# EasyEDA Pro project 四路舵机降压板.epro, board lm3150
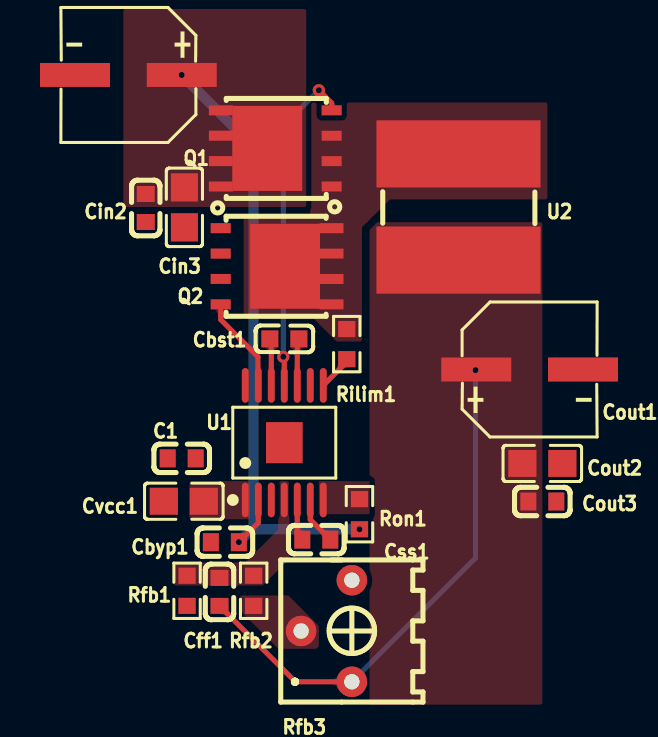
[diagram p5: board, top side]
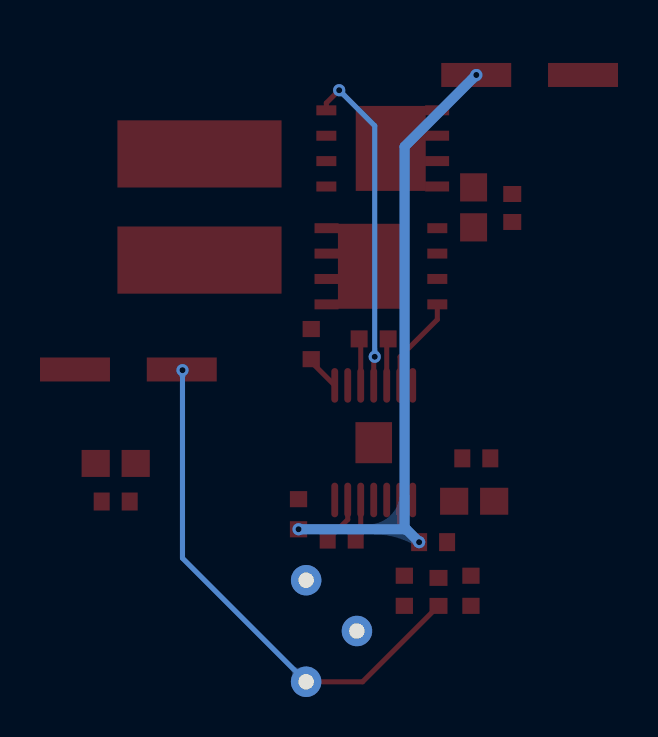
[diagram p6: board, bottom side, seen from below]

No outline. copper layers: Top Layer, Bottom Layer. Coordinates in mm from the lowest, leftmost part position.
Stack: Top Layer 0.035mm / Dielectric1 1.51mm FR4 er 4.5 / Bottom Layer 0.035mm

## Design rules (mm)
template: 自定义配置
spacing copperThickness1oz (default): track to track 0.102, other pairs 0.152 to 0.3
spacing copperThickness2oz: track to track 0.203, other pairs 0.152 to 0.3
track width copperThickness1oz (default): min 0.127, default 0.254, max 2.54
track width copperThickness2oz: min 0.203, default 0.254, max 2.54
differential pair differentialPair (default): width min 0.127, default 0.254, max 2.54; gap min 0.152, default 0.152
via viaSize (default): diameter min 0.5, default 0.61, max 10; hole min 0.3, default 0.305, max 6.3

## Placement (name value [footprint] x y rotation side)
C1  1nF  [C0603]  2.67 8.64 0 top
Cbst1  470nF  [CAP-SMD_L1.6-W0.8-3]  7.8 14.61 180 top
Cbyp1  100nF  [C0603]  4.83 4.45 0 top
Cff1  270pF  [C0603]  4.56 1.96 270 top
Cin1  220uF  [CAP-SMD_BD6.3-L6.6-W6.6-LS7.4-FD]  0 27.81 180 top
Cin2  100nF  [C0603]  0.87 21.16 90 top
Cin3  10uF  [C0805]  2.8 21.19 90 top
Cout1  220uF  [CAP-SMD_BD6.3-L6.6-W6.6-LS7.4-FD]  20.07 13.08 0 top
Cout2  10uF  [C0805]  20.7 8.38 180 top
Cout3  100nF  [C0603]  20.7 6.48 180 top
Css1  15nF  [C0603]  9.4 4.57 0 top
Cvcc1  2.2uF  [C0805]  2.77 6.49 0 top
Q1  TPH1R403NL  [DSOP-8_L5.0-W5.0-P1.27-LS6.0-BL-EP]  7.4 24.14 90 top
Q2  TPH1R403NL  [DSOP-8_L5.0-W5.0-P1.27-LS6.0-BL-EP]  7.39 18.24 270 top
Rfb1  10kΩ  [R0603]  2.93 2.01 90 top
Rfb2  113kΩ  [R0603]  6.27 2.01 270 top
Rfb3  20kΩ  [RES-ADJ-TH_3362P]  9.91 0 90 top
Rilim1  1.37kΩ  [R0603]  10.92 14.35 90 top
Ron1  267kΩ  [R0603]  11.56 5.84 90 top
U1  LM3150MHX/NOPB  [HTSSOP-14_L5.0-W4.4-P0.65-LS6.4-BL-EP]  7.8 9.42 0 top
U2  3.3uH  [IND-SMD_L7.8-W7.6]  16.51 21.21 90 top

## Footprints (pads in the part's own frame, mm; a bottom-side part is the same pattern mirrored in y, then rotated)
C0603
  rect 0.8x0.9 smd: 1(-0.7,0) 2(0.7,0)
C0805
  rect 1.41x1.35 smd: 1(-1,0) 2(1,0)
CAP-SMD_BD6.3-L6.6-W6.6-LS7.4-FD
  rect 3.5x1.2 smd: 1(-2.67,0) 2(2.67,0)
CAP-SMD_L1.6-W0.8-3
  rect 0.85x0.85 smd: 1(-0.725,0) 2(0.725,0)
DSOP-8_L5.0-W5.0-P1.27-LS6.0-BL-EP
  rect 0.5x1 smd: 1(-1.905,-2.77) 2(-0.635,-2.77) 3(0.634,-2.77) 4(1.905,-2.77)
  rect 0.5x1.2 smd: 5(1.905,2.77) 6(0.635,2.77) 7(-0.634,2.77) 8(-1.905,2.77)
  custom 4.25x3.5 smd: 9(0,0.45)
HTSSOP-14_L5.0-W4.4-P0.65-LS6.4-BL-EP
  oval 0.343x1.732 smd: 1(-1.95,-2.866) 2(-1.3,-2.866) 3(-0.65,-2.866) 4(0,-2.866) 5(0.65,-2.866) 6(1.3,-2.866) 7(1.95,-2.866) 8(1.95,2.866) 9(1.3,2.866) 10(0.65,2.866) 11(0,2.866) 12(-0.65,2.866) 13(-1.3,2.866) 14(-1.95,2.866)
  rect 1.83x2.055 smd: 15(0,0)
IND-SMD_L7.8-W7.6
  rect 3.36x8.208 smd: 1(2.655,0) 2(-2.655,0)
R0603
  rect 0.806x0.864 smd: 1(-0.753,0) 2(0.753,0)
RES-ADJ-TH_3362P
  round 1.524 hole 0.762: 1(-2.54,-1.27) 2(0,1.27) 3(2.54,-1.27)

## Nets
As in the schematic.

Pads without a net: Rfb3 3

## Via types
v1: diameter 0.61, hole 0.305, Top Layer to Bottom Layer, 6 vias

## Routing (per net, layer and track width the routed paths; a pad name or vN(x,y) marks a point on that pad's centre or on a via; arc(x,y) is an arc through that point)
GND: length 2.1
  Top Layer w0.254: U1.5 8.45,4.82 Css1.1
VIN: length 33
  Top Layer w0.254: v1(5.53,4.45) 6.5,5.42 U1.2
  Bottom Layer w0.508: 6.25,5.09 v1(11.56,5.09) ; 6.25,5.09 6.17,5.09 v1(5.53,4.45) ; 6.25,5.09 6.25,24.23 v1(2.67,27.81)
LG_1: length 4.8
  Top Layer w0.254: U1.13 6.48,12.31 6.48,13.72 4.62,15.58 Q2.4
VOUT: length 26.3
  Top Layer w0.254: Cff1.2 8.35,-2.54 Rfb3.1
  Bottom Layer w0.254: v1(17.36,13.05) 17.36,3.64 Rfb3.1
$1N1099: length 2.4
  Top Layer w0.254: 10.1,4.57 9.1,5.57 9.1,6.55
$1N1104: length 16.8
  Top Layer w0.254: U1.11 7.8,13.67 7.77,13.7 ; Q1.4 10.17,26.41 v1(9.53,27.05)
  Bottom Layer w0.254: v1(7.75,13.72) 7.75,25.27 v1(9.53,27.05)
$1N1105: length 2.4
  Top Layer w0.254: U1.12 7.15,14.54 Cbst1.2
$1N1106: length 1.8
  Top Layer w0.254: U1.8 10.92,13.46 Rilim1.1
$1N1119: length 2.4
  Top Layer w0.254: Cbst1.1 8.45,14.53 U1.10

## Copper pours and planes (outline as drawn; the poured copper is in the pictures)
VIN on Top Layer: -0.25,31.12 8.89,31.12 8.89,21.21 -0.25,21.21
FB_1 on Top Layer: 7.49,7.49 7.49,5.08 5.84,3.43 2.29,3.43 2.29,2.27 6.72,2.27 8.06,3.62 8.06,7.5 7.5,7.5
VOUT on Top Layer: 20.7,20.45 12.45,20.45 12.06,20.07 12.06,-3.68 20.7,-3.68
$1N1101 on Top Layer: 3.05,7.49 6.1,7.49 6.1,5.59 3.05,5.59
$1N1102 on Top Layer: 9.53,7.49 12.06,7.49 12.06,5.84 9.53,5.84
$1N1119 on Top Layer: 9.09,26.44 20.96,26.44 20.96,21.59 13.08,21.59 11.68,20.19 11.68,14.48 10.41,14.48 9.27,15.62 5.88,15.62 5.76,15.74 5.76,20.74 9.09,20.74
$1N1128 on Top Layer: 5.59,1.78 8,1.78 9.53,0.25 9.53,-0.76 9.4,-0.89 7.49,-0.89 5.59,1.02

Small or netless copper shapes (teardrops, artwork), in the pictures only: 20 on Top Layer, 8 on Bottom Layer
